# Altium schematic sheet pixel_pipeline.SchDoc
size A4
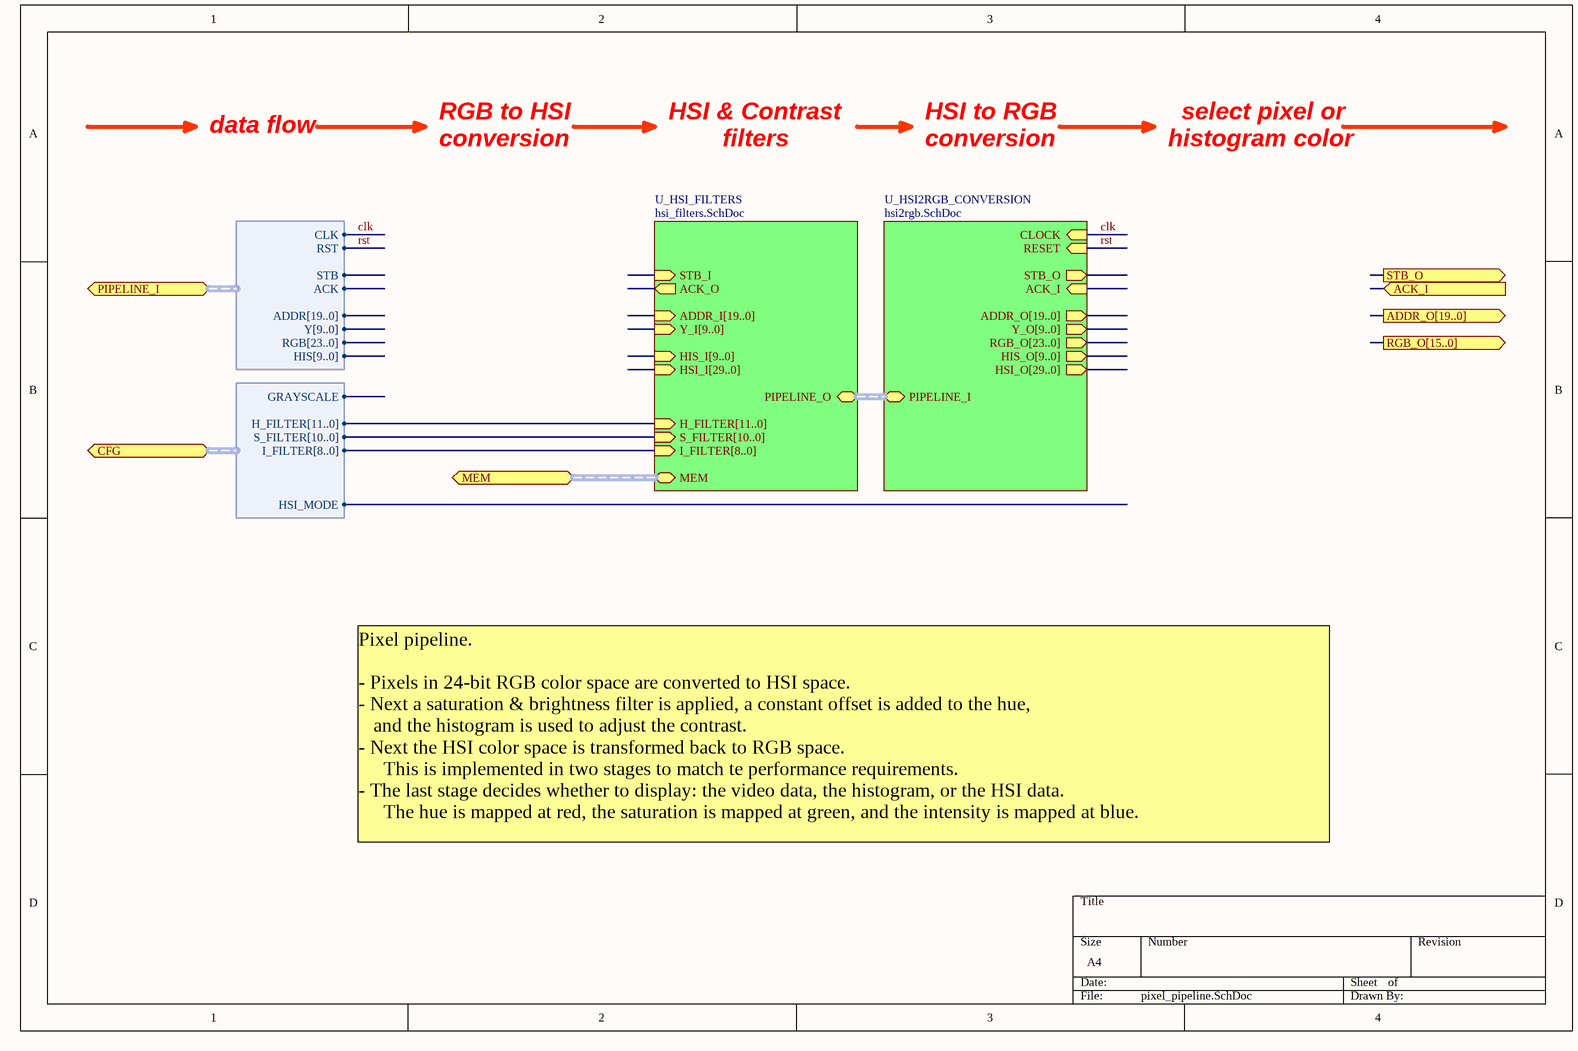
[diagram p0: pixel_pipeline.SchDoc]

## Sub-sheets
U_HSI2RGB_CONVERSION = hsi2rgb.SchDoc: ACK_I (in), STB_O (out), RGB_O[23..0] (out), ADDR_O[19..0] (out), HSI_O[29..0] (out), HIS_O[9..0] (out), Y_O[9..0] (out), CLOCK (in), RESET (in), PIPELINE_I (harness H_PIXEL_PIPELINE_1_5)
U_HSI_FILTERS = hsi_filters.SchDoc: MEM (harness WB_A11DAB32S), H_FILTER[11..0] (in), S_FILTER[10..0] (in), I_FILTER[8..0] (in), STB_I (in), ACK_O (out), HSI_I[29..0] (in), HIS_I[9..0] (in), ADDR_I[19..0] (in), Y_I[9..0] (in), PIPELINE_O (harness H_PIXEL_PIPELINE_1_5)

## Ports
ACK_I (in), ADDR_O[19..0] (out), CFG (harness H_CFG), MEM (harness WB_A11DAB32S), PIPELINE_I (harness H_PIXEL_PIPELINE_1_4), RGB_O[15..0] (out), STB_O (out)

## Harnesses
H_PIXEL_PIPELINE_1_4: ADDR[19..0], RGB[23..0], Y[9..0], HIS[9..0], STB, CLK, RST, ACK
H_CFG: GRAYSCALE, S_FILTER[10..0], HSI_MODE, I_FILTER[8..0], H_FILTER[11..0]

## Nets
clk: sheet U_HSI2RGB_CONVERSION/CLOCK, port PIPELINE_I.CLK
rst: sheet U_HSI2RGB_CONVERSION/RESET, port PIPELINE_I.RST

## Buses and harness runs
harness port MEM = sheet U_HSI_FILTERS/MEM
harness sheet U_HSI2RGB_CONVERSION/PIPELINE_I = sheet U_HSI_FILTERS/PIPELINE_O

## Notes on the sheet
- data flow
- RGB to HSI
- conversion
- HSI & Contrast
- filters
- HSI to RGB
- histogram color
- select pixel or
- Pixel pipeline.
  - Pixels in 24-bit RGB color space are converted to HSI space.
  - Next a saturation & brightness filter is applied, a constant offset is added to the hue,
  and the histogram is used to adjust the contrast.
  - Next the HSI color space is transformed back to RGB space.
  This is implemented in two stages to match te performance requirements.
  - The last stage decides whether to display: the video data, the histogram, or the HSI data.
  The hue is mapped at red, the saturation is mapped at green, and the intensity is mapped at blue.